# EAGLE design voltage_quadrupler (EAGLE 6.4)
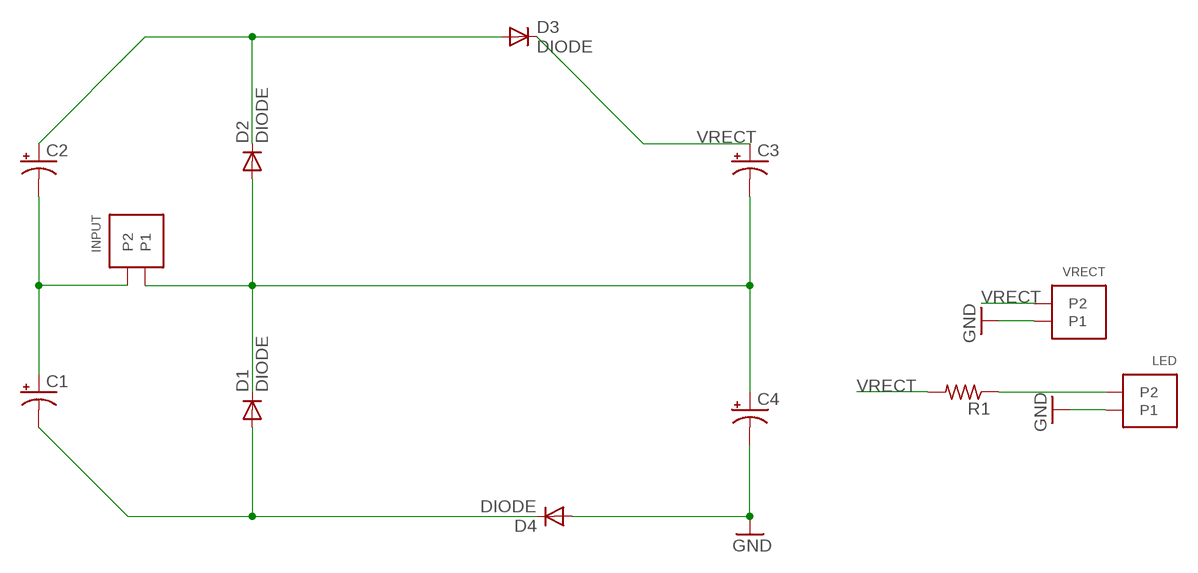
[diagram p0: schematic, sheet 1]

## Parts
C1  CPOL-USE7.5-18  [E7,5-18]
C2  CPOL-USE7.5-18  [E7,5-18]
C3  CPOL-USE7.5-18  [E7,5-18]
C4  CPOL-USE7.5-18  [E7,5-18]
D1  DIODE  [DO-214AB]
D2  DIODE  [DO-214AB]
D3  DIODE  [DO-214AB]
D4  DIODE  [DO-214AB]
INPUT  DF3-2  [DF3-2]
LED  DF3-2  [DF3-2]
R1  R-US_0207/7  [0207/7]
VRECT  DF3-2  [DF3-2]

## Nets
GND: C4.- D4.P$2(A) LED.P$1(P1) VRECT.P$1(P1)
N$1: C3.- C4.+ D1.P$1(C) D2.P$2(A) INPUT.P$1(P1)
N$2: C2.+ D2.P$1(C) D3.P$2(A)
N$4: C1.+ C2.- INPUT.P$2(P2)
N$6: C1.- D1.P$2(A) D4.P$1(C)
N$8: LED.P$2(P2) R1.1
VRECT: C3.+ D3.P$1(C) R1.2 VRECT.P$2(P2)

## Library data of the parts
C1-C4 = resistor:CPOL-US: POLARIZED CAPACITOR, American symbol
D1-D4 = crawford:DIODE: Diode SSC54-E3/57T SCHOTTKY 5A 40V package DO-214AB
INPUT LED VRECT = hirose:DF3-2
R1 = rcl:R-US_: RESISTOR, American symbol

## Board
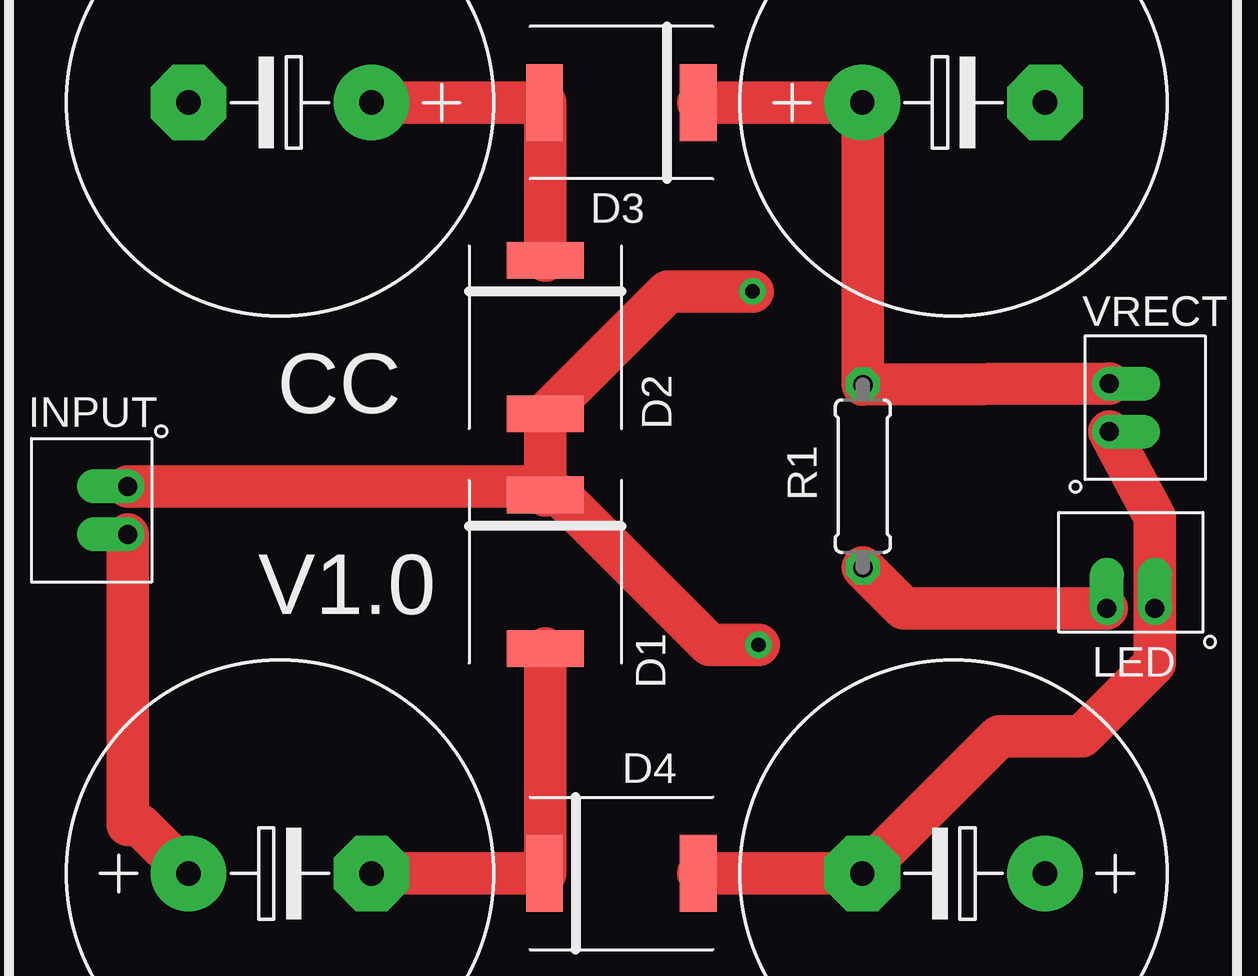
[diagram p1: board, top side]
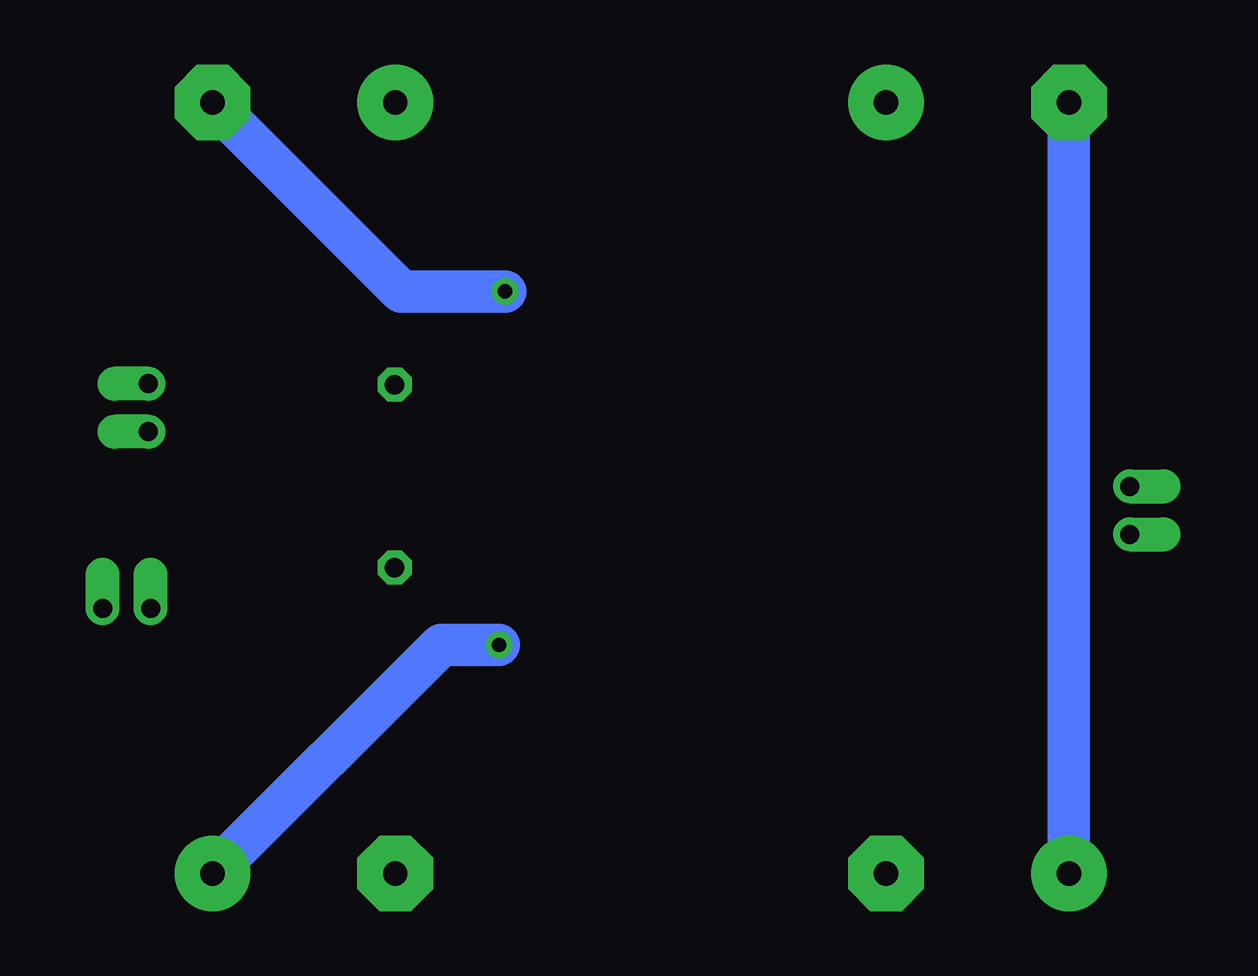
[diagram p2: board, bottom side, seen from below]

No outline drawn. Coordinates in mm, seen from the top.
Copper layers (1*16): Top 0.035mm / dielectric 1.5mm / Bottom 0.035mm
Design rules "SparkFun": minimum track width 8mil, minimum drill 20mil, track to track 8mil, track to pad 8mil, pad to pad 8mil, via to via 8mil, smd to smd 8mil, copper to edge 10mil, drill to drill 8mil, minimum pad ring 12mil, minimum via ring 10mil, stop-mask expansion 4mil, vias tented up to drill 25mil, thermal gap 10mil
Holes 3.2 mm at 25.4,2.54 25.4,48.26

### Footprints (pad centres in the part's own frame; a part is rotated, then mirrored left to right if it is on the bottom)
E7,5-18 = drill 1.016 pad 3.15: + -3.81,0 | drill 1.016 pad 3.15 octagon: - 3.81,0
DO-214AB = smd 1.524 x 3.2: P$1 -3.2,0; P$2 3.2,0
DF3-2 = drill 0.8 offset: P$1 0,0; P$2 -2,0
0207/7 = drill 0.813 octagon: 1 -3.81,0; 2 3.81,0

### Placement (x,y rotation side)
C1  11.3,9.27 0 top
C2  11.3,41.4 180 top
C3  39.37,41.4 0 top
C4  39.37,9.27 180 top
D1  22.35,21.84 270 top
D2  22.35,31.62 270 top
D3  25.53,41.4 180 top
D4  25.53,9.27 0 top
INPUT  4.95,25.4 90 top
LED  47.75,20.32 0 top
R1  35.59,25.83 90 top
VRECT  45.85,27.69 270 top

### Tracks (layer width: path | path; a pad name or v marks a point on that pad's centre or on a via)
GND
  Top 1.778: VRECT.P$1 47.75,24.13 LED.P$1 47.75,18.03 44.7,14.99 41.27,14.99 C4.- D4.P$2
N$1  (via drill 0.6)
  Top 1.778: D1.P$1 22.35,25.02 | 22.35,25.4 D2.P$2 27.46,33.53 v30.99,33.53 | D1.P$1 22.96,25.04 29.21,18.8 v31.24,18.8 | INPUT.P$1 22.35,25.4 | 22.35,25.4 D1.P$1
  Bottom 1.778: v30.99,33.53 35.31,33.53 C3.- | C4.+ 33.66,18.8 v31.24,18.8
N$2
  Top 1.778: C2.+ D3.P$2 22.35,41.4 D2.P$1
N$4
  Top 1.778: INPUT.P$2 4.95,11.3 5.46,11.3 C1.+
  Bottom 1.778: C2.- C1.+
N$6
  Top 1.778: D1.P$2 22.35,9.27 D4.P$1 C1.-
N$8
  Top 1.778: R1.1 37.29,20.32 LED.P$2
VRECT
  Top 1.778: D3.P$1 C3.+ 35.59,41.4 R1.2 VRECT.P$2

### Text on the board
tPlace: CC | V1.0